# EAGLE design ArduinoWiFiShield101 (EAGLE 6.5.0)
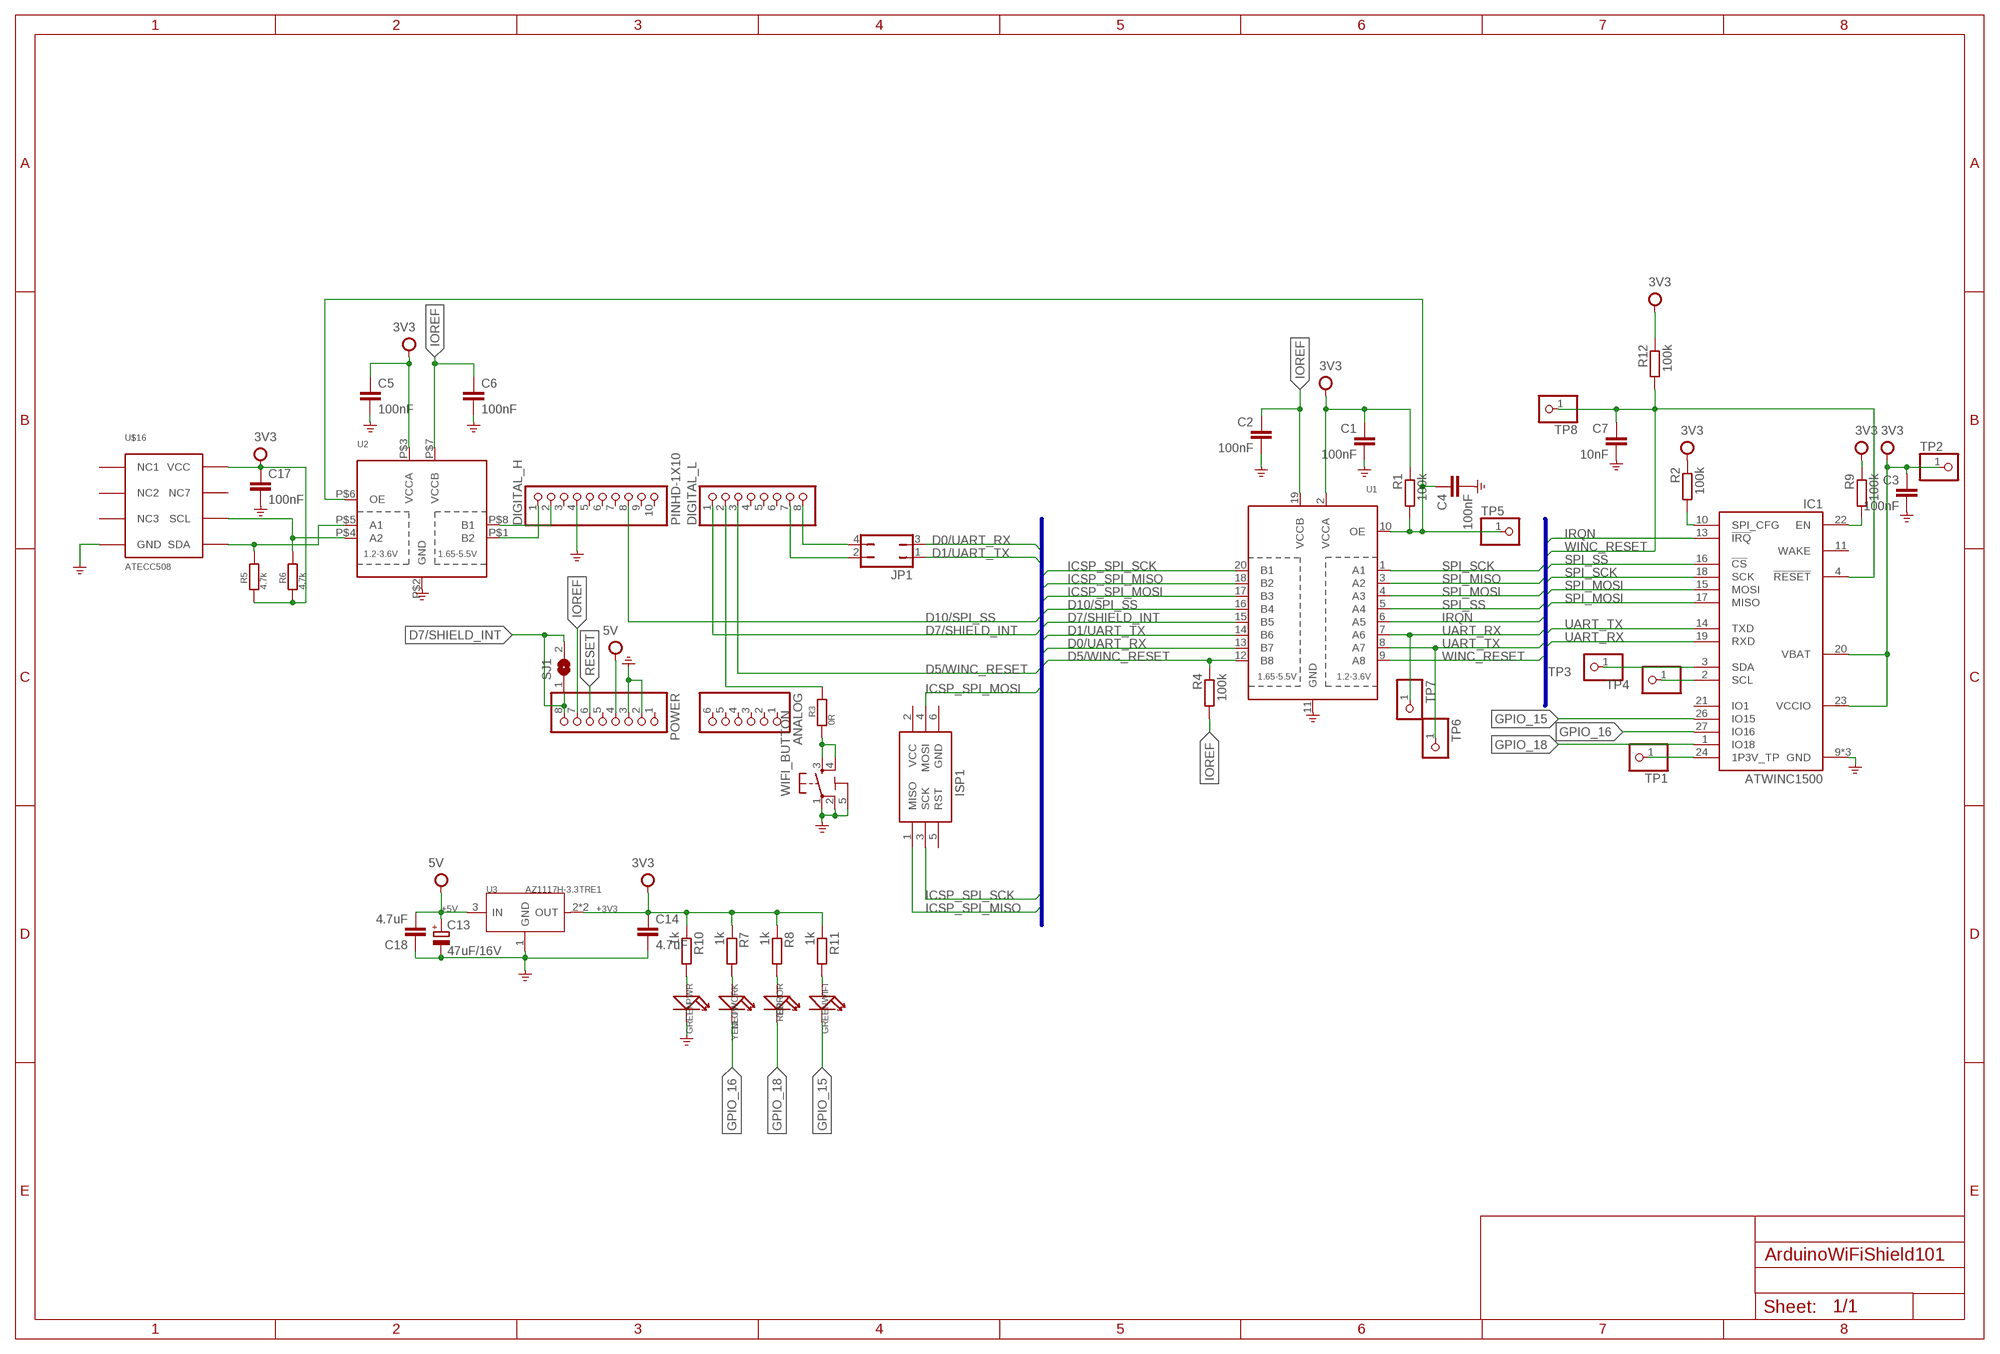
[diagram p0: schematic, sheet 1]

## Parts
ANALOG  PINHD-1X6B  [1X06-BIG]
C1  100nF  C-EUC0402  [C0402]
C2  100nF  C-EUC0402  [C0402]
C3  100nF  C-EUC0402  [C0402]
C4  100nF  C-EUC0402  [C0402]
C5  100nF  C-EUC0402  [C0402]
C6  100nF  C-EUC0402  [C0402]
C7  10nF  C-EUC0402  [C0402]
C13  47uF/16V  CPOL-EU140CLH-0810  [140CLH-0810]
C14  4.7uF  C-EUC0603  [C0603]
C17  100nF  C-EUC0402  [C0402]
C18  4.7uF  C-EUC0603  [C0603]
DIGITAL_H  PINHD-1X10  [1X10-BIG]
DIGITAL_L  PINHD-1X8BIG  [1X08-BIG]
ERROR  RED  LED'0603'  [LED-0603]
IC1  ATWINC1500  [ATWINC1500-MR210]
ISP1  AVRISP-6  [AVRISP]
JP1  JP2Q  [JP2Q]
NETWORK  YELLOW  LED'0603'  [LED-0603]
POWER  PINHD-1X8BIG  [1X08-BIG]
PWR  GREEN  LED'0603'  [LED-0603]
R1  100k  R-EU_R0402  [R0402]
R2  100k  R-EU_R0402  [R0402]
R3  0R  R-EU_R0402  [R0402]
R4  100k  R-EU_R0402  [R0402]
R5  4.7k  R-EU_R0402  [R0402]
R6  4.7k  R-EU_R0402  [R0402]
R7  1k  R-EU_R0402  [R0402]
R8  1k  R-EU_R0402  [R0402]
R9  100k  R-EU_R0402  [R0402]
R10  1k  R-EU_R0402  [R0402]
R11  1k  R-EU_R0402  [R0402]
R12  100k  R-EU_R0402  [R0402]
SJ1  SJ  [SJ]
TP1  PINHD-1X1_2.00  [1X01M]
TP2  PINHD-1X1_2.00  [1X01M]
TP3  PINHD-1X1_2.00  [1X01M]
TP4  PINHD-1X1_2.00  [1X01M]
TP5  PINHD-1X1_2.00  [1X01M]
TP6  PINHD-1X1_2.00  [1X01M]
TP7  PINHD-1X1_2.00  [1X01M]
TP8  PINHD-1X1_2.00  [1X01M]
U1  TXB0108PWR  [TSSOP20]
U2  TXS0102  [VFSOP-8]
U3  AZ1117H-3.3TRE1  LD1117S  [SOT-223]
U$16  ATECC508  [DFN-8.3X3.PAD]
WIFI  GREEN  LED'0603'  [LED-0603]
WIFI_BUTTON  TS42  [TS42]

## Nets
+3V3: C1.1 C3.1 C5.1 C14.1 C17.1 IC1.20(VBAT) IC1.23(VCCIO) R1.1 R2.1 R5.1 R6.1 R7.1 R8.1 R9.1 R10.1 R11.1 R12.1 TP2.1 U1.2(VCCA) U3.2(OUT) U3.TER(OUT) U$16.8(VCC) ; supply symbol labelled 3V3
+5V [usbvcc]: C13.+ C18.2 POWER.4 U3.3(IN) ; supply symbol labelled 5V
D0/UART_RX: JP1.3 U1.13(B7)
D1/UART_TX: JP1.1 U1.14(B6)
D5/WINC_RESET: DIGITAL_L.3 R4.1 U1.12(B8)
D7/SHIELD_INT: DIGITAL_L.1 POWER.8 SJ1.1 SJ1.2 U1.15(B5)
D10/SPI_SS: DIGITAL_H.8 U1.16(B4)
GND: C1.2 C2.2 C3.2 C4.2 C5.2 C6.2 C7.2 C13.- C14.2 C17.2 C18.1 DIGITAL_H.4 IC1.9(GND) IC1.12(GND) IC1.28(GND) POWER.2 POWER.3 PWR.- U1.11(GND) U2.P$2(GND) U3.1(GND) U$16.4(GND) U$16.PAD(GND) WIFI_BUTTON.1 WIFI_BUTTON.2 WIFI_BUTTON.5(5-GND)
GPIO_15: IC1.26(IO15) WIFI.-
GPIO_16: IC1.27(IO16) NETWORK.-
GPIO_18: ERROR.- IC1.1(IO18)
ICSP_SPI_MISO: ISP1.1(MISO) U1.18(B2)
ICSP_SPI_MOSI: ISP1.4(MOSI) U1.17(B3)
ICSP_SPI_SCK: ISP1.3(SCK) U1.20(B1)
IOREF: C2.1 C6.1 POWER.7 R4.2 U1.19(VCCB)
IRQN: IC1.13(!IRQ) U1.6(A5)
N$1: NETWORK.+ R7.2
N$2: DIGITAL_L.2 R3.1
N$3: DIGITAL_L.8 JP1.4
N$4: ERROR.+ R8.2
N$5: R11.2 WIFI.+
N$6: DIGITAL_L.7 JP1.2
N$7: C4.1 R1.2 TP5.1 U1.10(OE) U2.P$6(OE)
N$8: IC1.10(SPI_CFG) R2.2
N$9: IC1.22(EN) R9.2
N$10: DIGITAL_H.1 U2.P$1(B2)
N$11: R5.2 U2.P$5(A1) U$16.5(SDA)
N$12: IC1.24(1P3V_TP) TP1.1
N$13: IC1.3(SDA) TP3.1
N$14: IC1.2(SCL) TP4.1
N$15: R3.2 WIFI_BUTTON.3 WIFI_BUTTON.4
N$26: PWR.+ R10.2
RESET: POWER.6
SCL: R6.2 U2.P$4(A2) U$16.6(SCL)
SDA: DIGITAL_H.2 U2.P$8(B1)
SPI_MISO: IC1.17(MISO) U1.3(A2)
SPI_MOSI: IC1.15(MOSI) U1.4(A3)
SPI_SCK: IC1.18(SCK) U1.1(A1)
SPI_SS: IC1.16(!CS) U1.5(A4)
UART_RX: IC1.19(RXD) TP7.1 U1.7(A6)
UART_TX: IC1.14(TXD) TP6.1 U1.8(A7)
WINC_RESET: C7.1 IC1.4(!RESET) R12.2 TP8.1 U1.9(A8)
Unconnected: ANALOG.1 ANALOG.2 ANALOG.3 ANALOG.4 ANALOG.5 ANALOG.6 DIGITAL_H.3 DIGITAL_H.5 DIGITAL_H.6 DIGITAL_H.7 DIGITAL_H.9 DIGITAL_H.10 DIGITAL_L.4 DIGITAL_L.5 DIGITAL_L.6 IC1.11(WAKE) IC1.21(IO1) ISP1.5(RST) POWER.1 POWER.5 U2.P$3(VCCA) U2.P$7(VCCB) U$16.1(NC1) U$16.2(NC2) U$16.3(NC3) U$16.7(NC7)

## Buses
ICSP_SPI_SCK,ICSP_SPI_MISO,ICSP_SPI_MOSI,D10/SPI_SS,D7/SHIELD_INT,D0/UART_RX,D1/UART_TX,D5/WINC_RESET
SPI_SCK,SPI_MISO,SPI_MOSI,SPI_SS,IRQN,UART_RX,UART_TX,WINC_RESET

## Power pins joined to a net without a drawn wire
3V3: ISP1.2(VCC)
GND: ISP1.6(GND)

## Library data of the parts
ANALOG = adafruit:PINHD-1X6: PIN HEADER
C1-C7 C14 C17 C18 = rcl:C-EU: CAPACITOR, European symbol
C13 = rcl:CPOL-EU: POLARIZED CAPACITOR, European symbol
DIGITAL_H = adafruit:PINHD-1X10: Pin header 1x10 0.1" spacing With round pins
DIGITAL_L POWER = adafruit:PINHD-1X8: PIN HEADER
ERROR NETWORK PWR WIFI = Discrete:LED*
IC1 = we-chip:ATWINC1500: Atmel ATWINC1500-MR210 WiFi/WLAN 802.11 b/g/n
ISP1 = adafruit:AVRISP: AVR ISP HEADER Standard 6 pin header for AVR programming
JP1 = jumper:JP2Q: JUMPER
R1-R12 = rcl:R-EU_: RESISTOR, European symbol
SJ1 = jumper:SJ: SMD solder JUMPER
TP1-TP8 = pinhead-1:PINHD-1X1: PIN HEADER
U1 = adafruit:TXB0108PWR: 8-Bit Bi-Directional Level Shifter 1.2V-3.6V (VCCA) to 1.65V-5.5V (VCCB) bi-directional level shifter with auto direction sensing. Max data rate - VCCA 1.8V: 20Mbps (50ns), VCCA 3.3V: 100Mbps (10ns) Digikey: 296-21527-1-ND
U2 = adafruit:TXS0102: 2-Bit Bi-Directional Level Shifter (I2C, etc.) Designed for I2C devices and has internal pullups. Not to be confused with TXB010x series. 1.2V-3.6V (VCCA) to 1.65V-5.5V (VCCB) bi-directional level shifter with auto direction sensing. Max data rate - 24Mbps (Push Pull), 2Mbps (Open Drain) Digikey: 296-21931-1-ND
U3 = IC:LD1117: Low Drop Fixed And Adjustable Positive Voltage Regulators http://www.datasheetcatalog.org/datasheet/SGSThomsonMicroelectronics/mXuqtqv.pdf
U$16 = Arduino:ATECC508
WIFI_BUTTON = Arduino:TS42: TS42 Dongnan Electronics Tact switch VDC 12V - 50mA

## Net classes
0 default: width 0.203 mm, drill 0.305 mm, clearance 0.203 mm
3 usbvcc: width 0.203 mm, drill 0.305 mm, clearance 0.203 mm

## Board
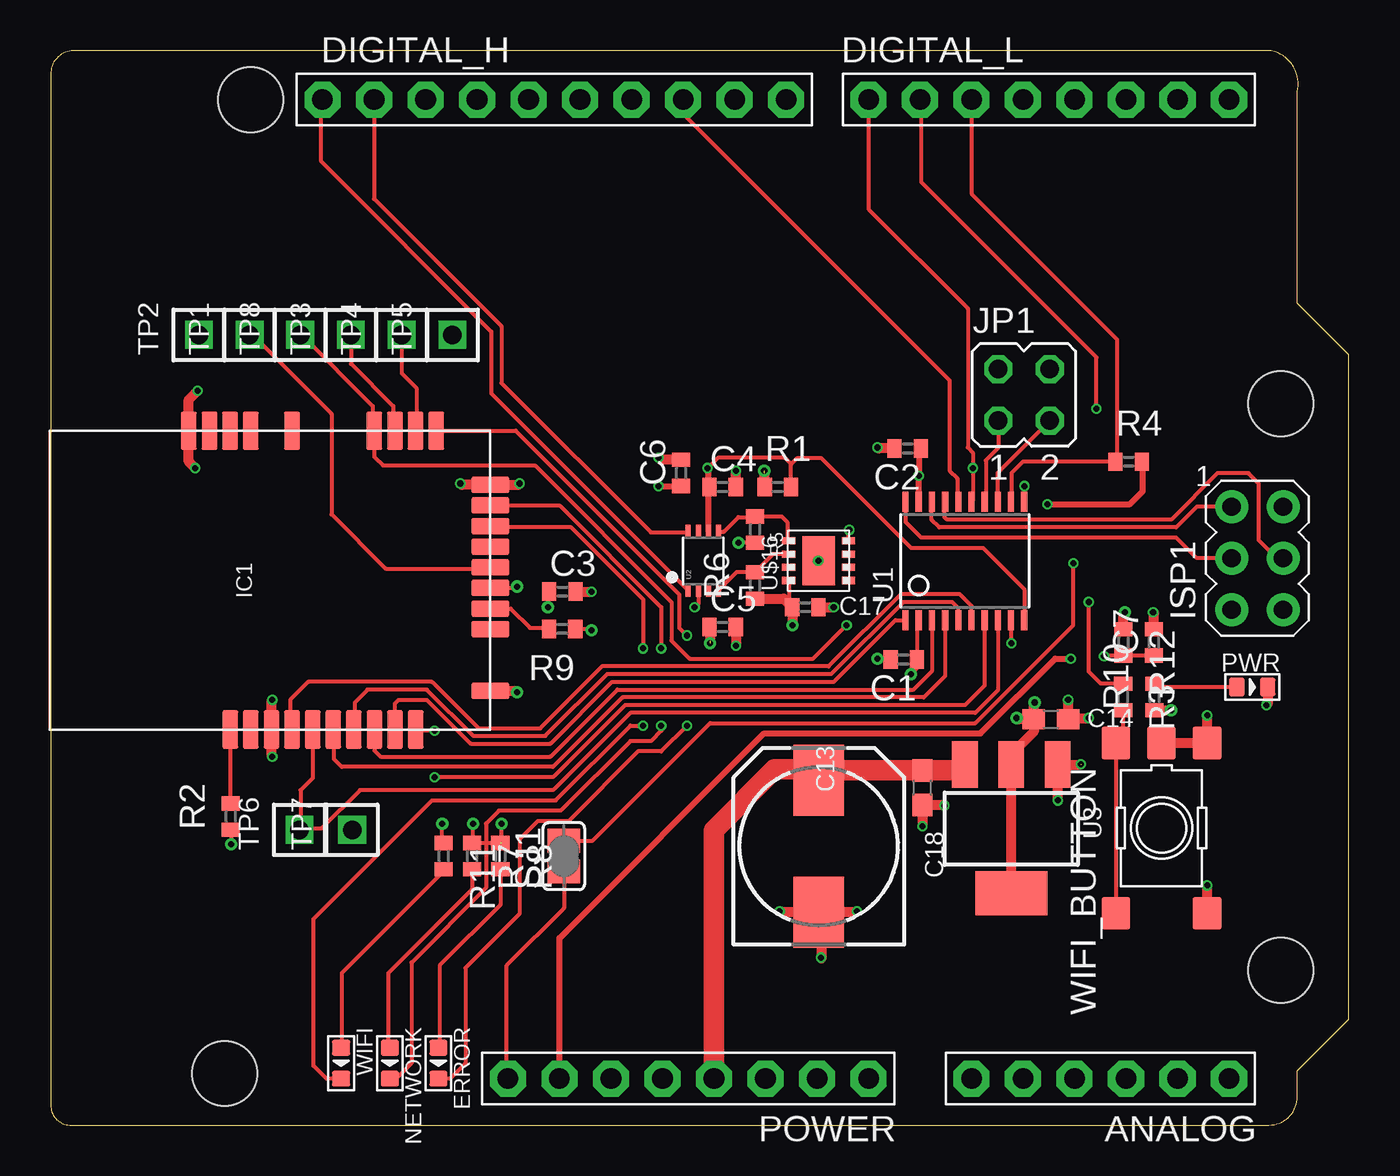
[diagram p1: board, top side]
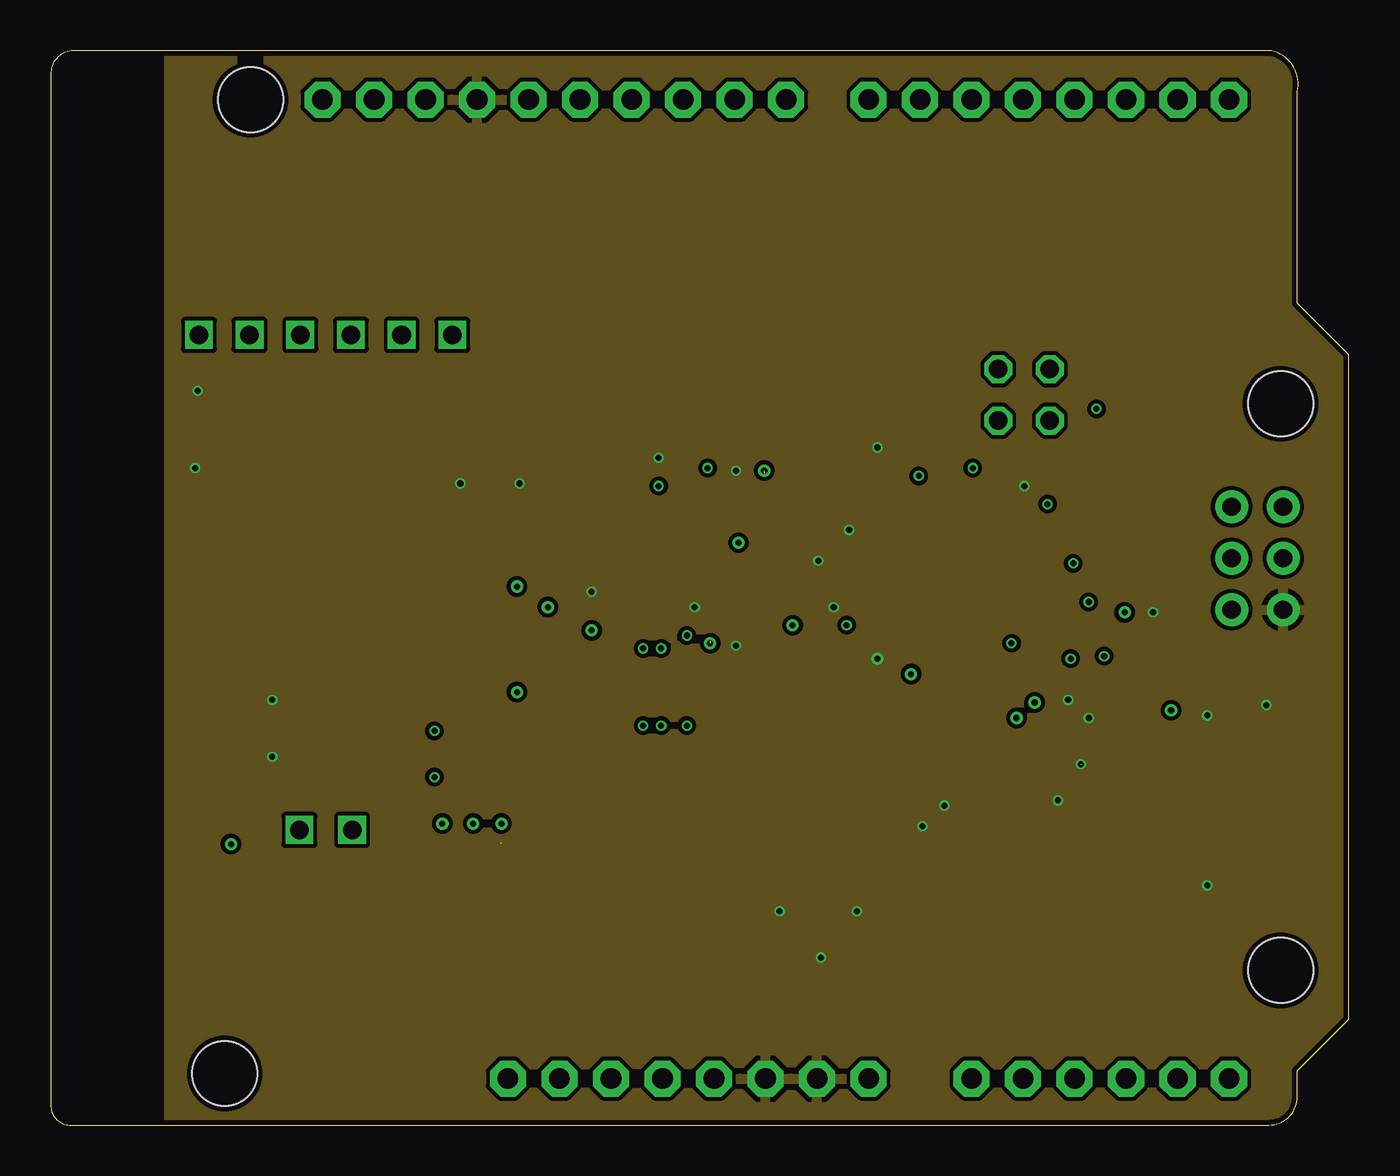
[diagram p2: board, inner layer GND_PLANE]
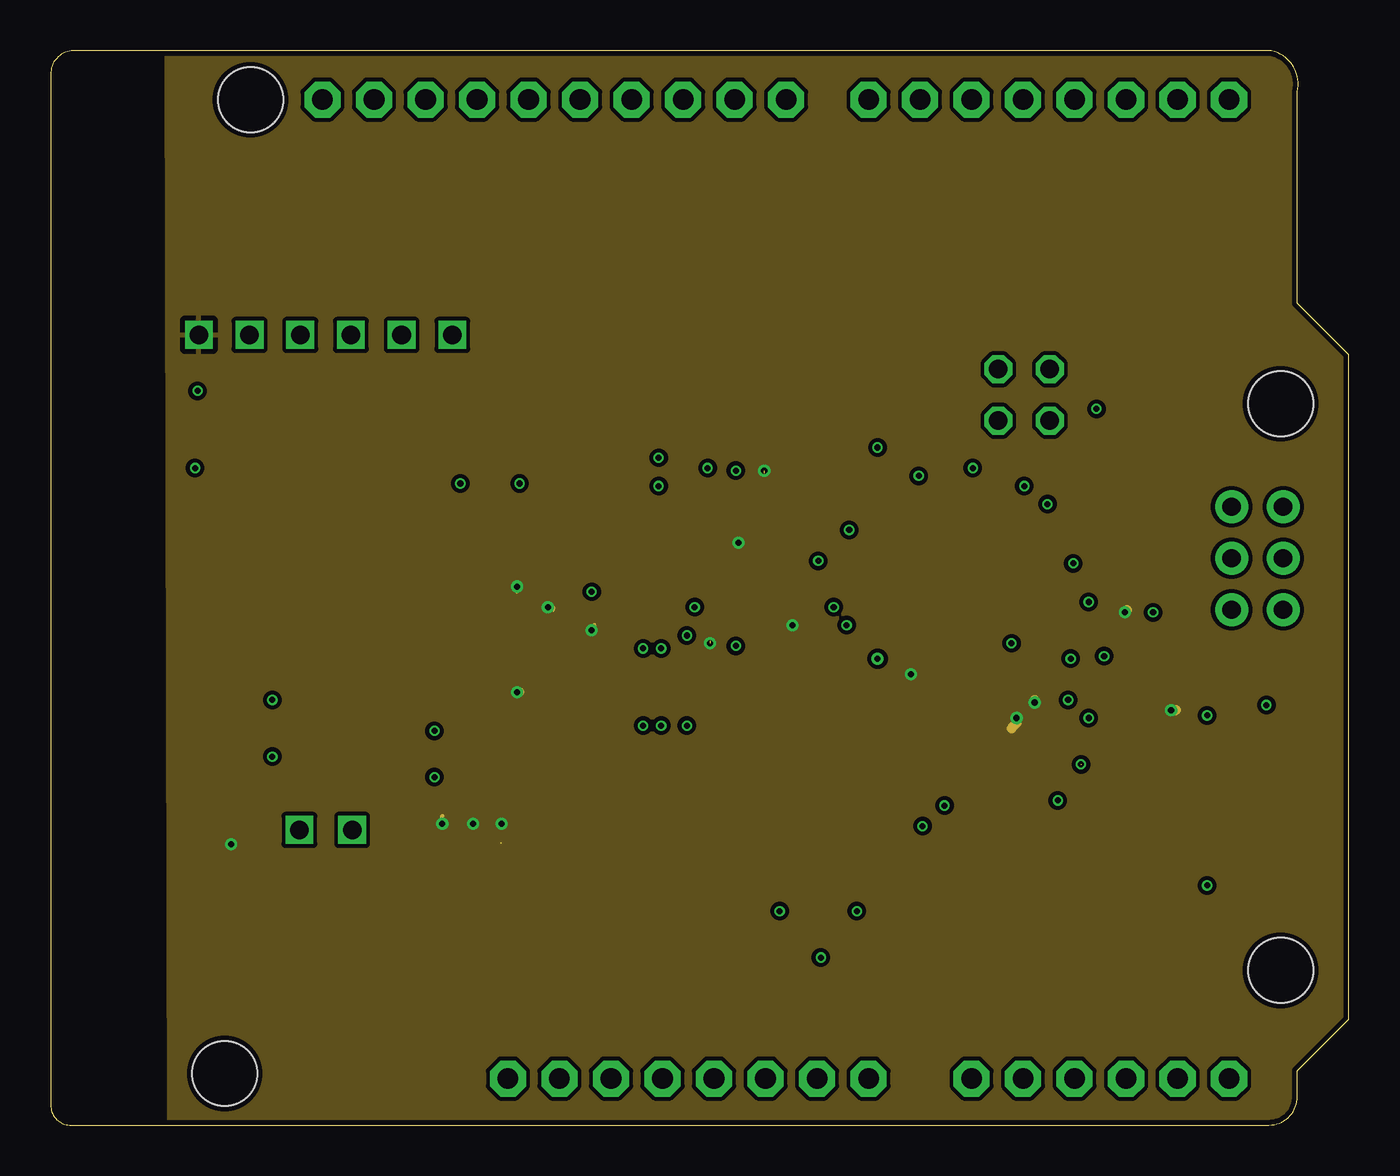
[diagram p3: board, inner layer POWER_PLANE]
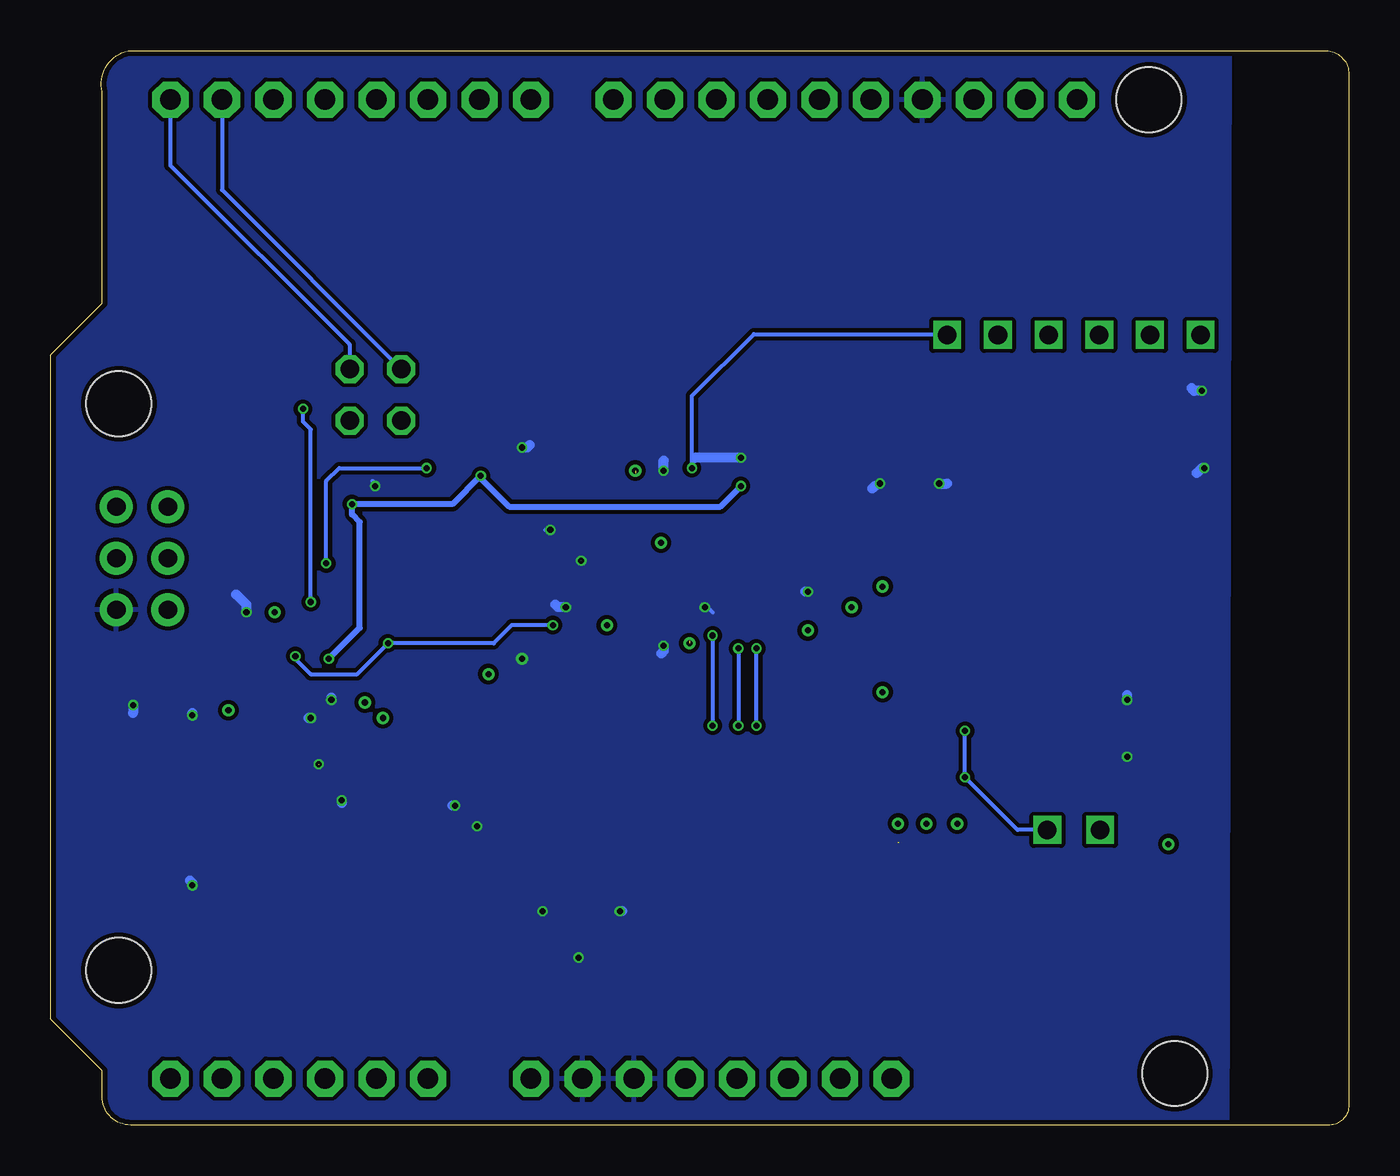
[diagram p4: board, bottom side, seen from below]

Size 64.01 x 52.96 mm. Coordinates in mm from the lower left corner, seen from the top.
Outline: 0.01,51.69 0.01,0.89 arc90 1.02,0 60.08,0 arc90 61.47,1.4 61.47,2.67 64.01,5.21 64.01,37.97 61.47,40.51 61.47,50.93 arc90 60.2,52.96 1.02,52.96 arc90 0.01,51.69
Copper layers (1*2*15*16): Top 0.035mm / dielectric 0.2mm / GND_PLANE 0.0175mm / dielectric 0.3mm / POWER_PLANE 0.0175mm / dielectric 0.2mm / Bottom 0.035mm
Design rules "SeeedStudio_4layer_DRU_no_angle_20140221 *": minimum track width 8mil, minimum drill 12mil, track to track 8mil, track to pad 8mil, pad to pad 8mil, via to via 8mil, smd to smd 0mil, copper to edge 10mil, drill to drill 8mil, minimum pad ring 6mil, minimum via ring 4mil, stop-mask expansion 4mil, vias tented up to drill 25mil, thermal gap 10mil
Holes 3.2 mm at 60.65,7.62 8.58,2.54 9.85,50.55 60.65,35.56

### Footprints (pad centres in the part's own frame; a part is rotated, then mirrored left to right if it is on the bottom)
1X06-BIG = drill 1.016 pad 1.778 octagon: 1 -6.35,0; 2 -3.81,0; 3 -1.27,0; 4 1.27,0; 5 3.81,0; 6 6.35,0
C0402 = smd 0.7 x 0.9: 1 -0.65,0; 2 0.65,0
140CLH-0810 = smd 3.5 x 2.5: + 3.25,0; - -3.25,0
C0603 = smd 1.1 x 1: 1 -0.85,0; 2 0.85,0
1X10-BIG = drill 1.016 pad 1.778 octagon: 1 -11.43,0; 2 -8.89,0; 3 -6.35,0; 4 -3.81,0; 5 -1.27,0; 6 1.27,0; 7 3.81,0; 8 6.35,0; 9 8.89,0; 10 11.43,0
1X08-BIG = drill 1.016 pad 1.778 octagon: 1 -8.89,0; 2 -6.35,0; 3 -3.81,0; 4 -1.27,0; 5 1.27,0; 6 3.81,0; 7 6.35,0; 8 8.89,0
LED-0603 = smd 0.762 x 0.889: + -0.762,0; - 0.762,0
ATWINC1500-MR210 = smd 1.9 x 0.8: 1 7.365,-8.19; 2 7.365,-7.174; 3 7.365,-6.158; 4 7.365,-5.142; 5 7.365,-1.078; 6 7.365,0.954; 7 7.365,1.97; 8 7.365,2.986; 9 7.365,4.002; 10 -7.365,1.964; 11 -7.365,0.948; 12 -7.365,-0.068; 13 -7.365,-1.084; 14 -7.365,-2.1; 15 -7.365,-3.116; 16 -7.365,-4.132; 17 -7.365,-5.148; 18 -7.365,-6.164; 19 -7.365,-7.18 | smd 0.8 x 1.9: 20 -5.465,-10.86; 21 -2.417,-10.86; 22 -1.401,-10.86; 23 -0.385,-10.86; 24 0.631,-10.86; 25 1.647,-10.86; 26 2.663,-10.86; 27 3.679,-10.86; 28 4.695,-10.86
AVRISP = drill 0.9 pad 1.626: 1 -1.27,2.54; 2 1.27,2.54; 3 -1.27,0; 4 1.27,0; 5 -1.27,-2.54; 6 1.27,-2.54
JP2Q = drill 0.914 octagon: 1 -1.27,-1.27; 2 -1.27,1.27; 3 1.27,-1.27; 4 1.27,1.27
R0402 = smd 0.7 x 0.9: 1 -0.65,0; 2 0.65,0
SJ = smd 1.168 x 1.6: 1 -0.762,0; 2 0.762,0
1X01M = drill 0.914 square: 1 0,0
TSSOP20 = smd 0.305 x 0.991: 1 -2.925,-2.918; 2 -2.275,-2.918; 3 -1.625,-2.918; 4 -0.975,-2.918; 5 -0.325,-2.918; 6 0.325,-2.918; 7 0.975,-2.918; 8 1.625,-2.918; 9 2.275,-2.918; 10 2.925,-2.918; 11 2.925,2.918; 12 2.275,2.918; 13 1.625,2.918; 14 0.975,2.918; 15 0.325,2.918; 16 -0.325,2.918; 17 -0.975,2.918; 18 -1.625,2.918; 19 -2.275,2.918; 20 -2.925,2.918
VFSOP-8 = smd 0.25 x 0.65: P$1 -0.75,-1.45; P$2 -0.25,-1.45; P$3 0.25,-1.45; P$4 0.75,-1.45; P$5 0.75,1.45; P$6 0.25,1.45; P$7 -0.25,1.45; P$8 -0.75,1.45
SOT-223 = smd 1.27 x 2.286: 1 -2.286,-3.175; 2 0,-3.175; 3 2.286,-3.175 | smd 3.556 x 2.159: TER 0,3.175
DFN-8.3X3.PAD = smd 0.35 x 0.65: 1 -0.975,-1.475; 2 -0.325,-1.475; 3 0.325,-1.475; 4 0.975,-1.475; 5 0.975,1.475; 6 0.325,1.475; 7 -0.325,1.475; 8 -0.975,1.475 | smd 2.4 x 1.6: PAD 0,0
TS42 = smd 1.6 x 1.4: 1 -4.2,2.25; 2 4.2,2.25; 3 -4.2,-2.25; 4 4.2,-2.25; 5 -4.2,0

### Placement (x,y rotation side)
ANALOG  51.76,2.29 180 top
C1  42.07,22.95 180 top
C2  42.26,33.35 180 top
C3  25.23,26.3 0 top
C4  33.14,31.45 0 top
C5  33.14,24.55 0 top
C6  31.09,32.15 90 top
C7  54.4,23.79 90 top
C13  37.88,13.74 90 top
C14  49.33,20 0 top
C17  37.22,25.53 0 top
C18  42.99,16.63 90 top
DIGITAL_H  24.84,50.55 0 top
DIGITAL_L  49.22,50.55 0 top
ERROR  19.12,3.05 270 top
IC1  10.82,26.86 90 top
ISP1  59.51,27.94 0 top
JP1  48,35.99 0 top
NETWORK  16.72,3.05 270 top
POWER  31.44,2.29 180 top
PWR  59.25,21.59 0 top
R1  35.86,31.45 0 top
R2  8.88,15.2 90 top
R3  52.88,21.1 270 top
R4  53.16,32.7 0 top
R5  34.74,29.35 90 top
R6  34.74,26.6 90 top
R7  20.78,13.25 270 top
R8  22.18,13.25 270 top
R9  25.22,24.46 180 top
R10  54.43,21.1 90 top
R11  19.38,13.25 270 top
R12  52.9,23.79 270 top
SJ1  25.31,13.25 90 top
TP1  9.81,38.95 0 top
TP2  7.31,38.95 0 top
TP3  14.81,38.95 0 top
TP4  17.31,38.95 0 top
TP5  19.81,38.95 0 top
TP6  12.27,14.55 0 top
TP7  14.87,14.55 0 top
TP8  12.31,38.95 0 top
U1  45.08,27.81 0 top
U2  32.19,27.81 0 top
U3  47.37,14.61 180 top
U$16  37.87,27.82 90 top
WIFI  14.32,3.05 270 top
WIFI_BUTTON  54.78,14.63 270 top

### Tracks (layer width: path | path; a pad name or v marks a point on that pad's centre or on a via)
+3V3  (via drill 0.3 pad 0.6)  (3 unrouted)
  Top 0.2: R11.1 19.31,13.9 v19.31,14.86 | v20.83,14.86 20.83,13.9 R7.1 22.23,13.9 v22.23,14.86 | R2.1 8.9,14.55 v8.9,13.84 | IC1.23 22.99,26.48 v22.99,26.54 | C3.1 24.52,26.3 v24.52,25.53 | R9.1 26.68,24.46 v26.68,24.39 | U1.2 42.72,24.89 C1.1 42.72,22.52 v42.42,22.23 | U$16.8 36.39,25.7 C17.1 | 36.57,24.65 v36.58,24.64 | R5.1 v33.92,28.7
  Top 0.5: IC1.20 22.99,21.4 v22.99,21.34 | 36.57,24.65 C17.1 36.14,25.95 R6.1 | U3.TER U3.2 47.38,17.79 47.38,18.29 48.48,19.39 C14.1 | C14.1 48.48,20.79 v48.52,20.83 | C14.1 47.7,20 v47.63,20.07 | R12.1 52.9,25.08 v52.97,25.27 | R10.1 v55.25,20.45 | C5.1 32.52,24.55 32.52,23.88 | R1.1 35.21,32.11 35.19,32.13
  POWER_PLANE 0.2: v19.31,14.86 19.31,15.24 | v20.83,14.86 20.83,14.99 | v22.23,14.86 22.23,14.99 | v8.9,13.84 8.9,13.72 | v22.99,26.54 22.99,26.29 | v24.52,25.53 24.77,25.53 24.77,25.4 | v26.68,24.39 26.8,24.39 26.8,24.64 | v42.42,22.23 42.3,22.1 | v36.58,24.64 36.46,24.64
  POWER_PLANE 0.5: v22.99,21.34 23.12,21.34 | v48.52,20.83 48.52,20.96 | v47.63,20.07 47.63,19.81 47.38,19.56 | v52.97,25.27 53.09,25.4 | v55.25,20.45 55.51,20.45
  other vias: 32.52,23.75 35.19,32.26
  pour POWER_PLANE: 5.72,52.96 60.46,52.96 61.09,52.58 61.35,52.07 61.47,51.56 61.47,40.51 64.01,37.97 64.01,5.08 61.47,2.67 61.35,1.02 61.22,0.51 60.59,0 5.85,0
+5V
  Top 0.813: 37.9,17.48 C13.+
  Top 1: POWER.4 32.71,14.54 35.69,17.53 37.85,17.53 C13.+ | 37.9,17.48 C18.2 44.78,17.48 U3.3
D0/UART_RX
  Top 0.2: U1.13 46.71,32.16 JP1.3
D1/UART_TX
  Top 0.2: JP1.1 46.73,33.39 46.11,32.77 46.11,30.78 U1.14
D5/WINC_RESET
  Top 0.2: DIGITAL_L.3 45.41,45.91 52.58,38.74 52.58,32.78 R4.1 47.95,32.7 47.38,32.13 47.38,30.75 U1.12
D7/SHIELD_INT  (via drill 0.3)
  Top 0.2: DIGITAL_L.1 40.33,45.15 45.22,40.26 45.22,33.4 45.47,33.15 v45.47,32.39 45.47,30.79 U1.15 | v50.43,27.69 50.43,24.64 45.6,19.81 32.52,19.81 26.72,14.02 SJ1.2 SJ1.1 25.31,10.7 22.49,7.88 22.49,2.29 POWER.8
  Bottom 0.2: v45.47,32.39 49.79,32.39 50.43,31.75 v50.43,27.69
D10/SPI_SS
  Top 0.2: DIGITAL_H.8 31.19,49.85 44.33,36.7 44.33,32.26 44.71,31.88 44.71,30.77 U1.16
GND  (via drill 0.3, 0.3 pad 0.6)  (2 unrouted)
  Top 0.2: U1.11 v48.01,31.49 v48.01,31.5 | U$16.4 39.34,29.31 v39.38,29.34 | U2.P$2 31.94,25.71 v31.76,25.53 | C1.2 40.81,22.95 v40.77,22.99
  Top 0.5: v23.12,31.62 23.06,31.56 IC1.28 20.27,31.56 v20.2,31.62 | v10.93,20.96 10.89,20.91 IC1.12 10.89,18.23 | v35.95,10.54 36,10.49 C13.- 38,10.49 | 39.65,10.49 38,10.49 | 38,10.49 38,8.21 | v44.08,15.75 44.05,15.78 C18.1 42.99,14.76 | U3.1 49.65,16.01 v49.66,16 | 49.79,17.77 50.8,17.77 | C14.2 v50.18,20.95 v50.17,20.96 | 50.23,20.06 v51.18,20.06 v51.19,20.07 | v57.03,20.19 WIFI_BUTTON.1 WIFI_BUTTON.5 | WIFI_BUTTON.2 v57.03,11.81 | PWR.- 60.02,20.77 v59.95,20.7 | v7.25,36.2 6.82,35.77 IC1.9 6.82,32.7 6.86,32.66 6.86,32.64 v7.12,32.39 | C6.2 30.07,32.8 v29.98,32.89 | C4.2 v33.79,32.26 | C17.2 v38.61,25.53 | C5.2 v33.79,23.63 v33.79,23.62 | C2.2 40.82,33.35 v40.77,33.4 | C3.2 v26.67,26.3 v26.68,26.29 | C7.2 54.4,25.24 v54.36,25.27
  Bottom 0.2: v48.01,31.5 48.01,31.62 48.14,31.75 | v39.38,29.34 39.63,29.34 | v31.76,25.53 31.63,25.53 31.38,25.27 | v40.77,22.99 40.65,22.99
  Bottom 0.5: v23.12,31.62 23.37,31.5 23.5,31.37 | v20.2,31.62 19.82,31.62 | v10.93,20.96 10.93,21.21 | 35.82,10.54 v35.95,10.54 | v44.08,15.75 44.2,15.75 | v49.66,16 49.66,15.88 | v50.17,20.96 50.17,21.08 | v51.19,20.07 51.31,20.07 | v57.03,20.19 57.03,20.32 | v57.03,11.81 57.03,11.94 57.16,12.07 | v59.95,20.7 59.95,20.32 | v7.25,36.2 7.63,36.2 7.75,36.32 | v7.12,32.39 7.25,32.39 7.5,32.13 | v29.98,32.89 32.26,32.89 | v33.79,32.26 33.79,32.77 | v38.61,25.53 39,25.53 39.12,25.66 | v33.79,23.62 33.79,23.37 33.92,23.24 | v40.77,33.4 40.52,33.4 40.39,33.53 | v26.68,26.29 26.8,26.29 | v54.36,25.27 54.36,25.66 54.87,26.16
  other vias: 10.93,18.16 39.76,10.54 37.98,8.26 42.99,14.73 50.81,17.78 37.85,27.81
  pour Bottom: 5.85,55.12 65.67,55.25 65.67,-2.92 5.98,-3.05
  pour GND_PLANE: 5.72,52.96 arc-90 5.85,53.09 60.08,53.09 arc-90 61.35,51.82 61.35,50.67 arc-90 61.47,50.55 61.47,40.51 64.01,37.97 64.01,5.34 61.47,2.67 61.47,1.27 arc-90 60.33,0.13 5.85,0.13 5.85,52.83 arc90
GPIO_15  (via drill 0.3)
  Top 0.2: WIFI.- 13.6,2.29 12.96,2.92 12.96,10.16 18.8,16 24.9,16 28.58,19.69 v29.22,19.69 | IC1.26 21.74,29.47 25.66,29.47 29.22,25.91 v29.22,23.5
  Bottom 0.2: v29.22,19.69 v29.22,23.5
GPIO_16  (via drill 0.3)
  Top 0.2: v30.11,19.69 30.11,19.43 29.6,18.92 28.58,18.92 25.15,15.5 22.1,15.5 21.47,14.86 21.47,11.69 17.79,8 17.79,3.05 17.02,2.29 NETWORK.- | IC1.27 25.09,30.54 30.11,25.53 v30.11,23.5
  Bottom 0.2: v30.11,23.5 v30.11,19.69
GPIO_18  (via drill 0.3)
  Top 0.2: IC1.1 22.93,34.23 30.99,26.16 30.99,24.51 v31.38,24.13 | v31.38,19.69 30.11,18.42 28.96,18.42 25.53,14.99 24.01,14.99 23.12,14.1 23.12,10.42 20.45,7.75 20.45,3.05 19.69,2.29 ERROR.-
  Bottom 0.2: v31.38,24.13 v31.38,19.69
ICSP_SPI_MISO
  Top 0.2: ISP1.1 56.52,30.48 55.51,29.47 43.82,29.47 43.44,29.85 43.44,30.71 U1.18
ICSP_SPI_MOSI
  Top 0.2: ISP1.4 60.46,27.94 59.57,28.83 59.57,31.62 59.06,32.13 57.54,32.13 55.25,29.85 44.2,29.85 44.08,29.97 44.08,30.7 U1.17
ICSP_SPI_SCK
  Top 0.2: ISP1.3 56.52,27.94 55.51,28.96 42.93,28.96 42.17,29.72 42.17,30.71 U1.20
IOREF  (via drill 0.3)
  Top 0.2: 42.81,33.25 C2.1
  Top 0.3: POWER.7 25.09,9.21 35.19,19.31 45.85,19.31 49.54,22.99 v50.3,22.99 | v49.16,30.61 53.22,30.61 53.85,31.24 53.85,32.65 R4.2 | U1.19 v42.81,32.01 42.81,33.25 | v29.98,31.5 C6.1
  Bottom 0.3: v50.3,22.99 48.77,24.51 48.77,29.72 49.16,30.1 v49.16,30.61 44.2,30.61 v42.81,32.01 42.81,31.88 41.41,30.48 30.99,30.48 v29.98,31.5
IRQN
  Top 0.2: U1.6 45.41,25.6 44.84,26.16 41.92,26.16 38.36,22.61 27.18,22.61 24.14,19.56 21.09,19.56 18.8,21.85 12.71,21.85 11.82,20.96 11.82,19.58 IC1.13
N$1
  Top 0.2: R7.2 20.78,11.63 16.64,7.49 16.64,3.89 NETWORK.+
N$2  (via drill 0.3)
  Top 0.2: R3.1 51.79,21.75 51.19,22.35 v51.19,25.78 | v51.57,35.31 51.57,37.85 42.93,46.48 42.93,50.74 DIGITAL_L.2
  Bottom 0.2: v51.19,25.78 51.19,34.29 51.57,34.67 v51.57,35.31
N$3
  Bottom 0.2: DIGITAL_L.8 58.11,47.31 49.28,38.48 49.28,37.27 JP1.4
N$4
  Top 0.2: R8.2 22.18,10.87 19.18,7.88 19.18,3.87 ERROR.+
N$5
  Top 0.2: R11.2 19.38,12.52 14.36,7.49 14.36,3.85 WIFI.+
N$6
  Bottom 0.2: DIGITAL_L.7 55.57,46.1 JP1.2
N$7  (via drill 0.3)
  Top 0.2: v32.39,32.39 32.9,32.89 36.2,32.89 36.51,32.59 R1.2 36.51,32.56 36.84,32.89 37.98,32.89 42.42,28.45 45.98,28.45 48.01,26.42 U1.10
  Top 0.3: U2.P$6 32.44,31.4 | 32.44,31.4 C4.1 | 32.44,31.4 32.44,32.34 v32.39,32.39
  Bottom 0.2: v32.39,32.39 32.39,35.94 29.34,38.99 19.84,38.99
  Bottom 0.3: 19.84,38.99 TP5.1
N$8
  Top 0.2: R2.2 8.88,19.47 IC1.10
N$9
  Top 0.2: IC1.22 22.68,25.46 23.63,24.51 24.52,24.51 R9.2
N$10
  Top 0.2: DIGITAL_H.1 13.34,50.74 13.34,47.5 21.72,39.12 21.72,36.07 U2.P$1 31.38,26.42
N$11
  Top 0.2: U2.P$5 33.2,29.26 33.92,29.97 34.71,29.97 R5.2 36.05,30 36.33,29.72 36.33,28.86 U$16.5
N$12
  Top 0.2: TP1.1 9.95,38.95 13.85,35.05 13.85,30.1 16.52,27.43 21.62,27.43 IC1.24
N$13
  Top 0.2: TP3.1 14.81,37.53 16.9,35.43 16.9,34.31 IC1.3
N$14
  Top 0.2: TP4.1 17.31,37.06 18.04,36.32 18.04,34.28 IC1.2
N$15
  Top 0.2: WIFI_BUTTON.4 WIFI_BUTTON.3 52.88,19.18 R3.2
N$26
  Top 0.2: PWR.+ 54.59,21.59 R10.2
SCL
  Top 0.2: U2.P$4 33.83,27.25 R6.2 35.63,28.15 U$16.6
SDA
  Top 0.2: DIGITAL_H.2 15.95,45.66 22.23,39.37 22.23,36.58 29.6,29.21 31.39,29.21 U2.P$8
SPI_MISO
  Top 0.2: U1.3 43.46,22.37 42.55,21.46 27.95,21.46 24.64,18.16 16.26,18.16 15.97,18.46 IC1.17
SPI_MOSI
  Top 0.2: U1.4 44.11,22.13 43.06,21.08 28.2,21.08 24.77,17.65 14.36,17.65 13.98,18.04 13.98,19.46 IC1.15
SPI_SCK
  Top 0.2: IC1.18 16.98,20.79 17.15,20.96 18.55,20.96 20.71,18.8 24.64,18.8 27.69,21.85 38.61,21.85 41.66,24.89 U1.1
SPI_SS
  Top 0.2: U1.5 44.76,25.48 44.46,25.78 42.04,25.78 38.49,22.23 27.44,22.23 24.39,19.18 20.83,19.18 18.55,21.46 15.63,21.46 14.99,20.83 14.99,19.54 IC1.16
UART_RX  (via drill 0.3)
  Top 0.2: U1.7 46.06,21.67 45.09,20.7 28.33,20.7 24.77,17.15 v18.93,17.15 | v18.93,19.43 18.06,19.43 IC1.19
  Bottom 0.2: v18.93,19.43 v18.93,17.15 16.33,14.55 TP7.1
UART_TX
  Top 0.2: IC1.14 12.92,17.1 12.33,16.51 12.33,14.61 TP6.1 12.32,14.61 13.34,14.61 15.25,16.51 24.77,16.51 28.58,20.32 45.6,20.32 46.71,21.43 U1.8
WINC_RESET  (via drill 0.3)
  Top 0.2: C7.1 R12.2 51.98,23.14 v51.95,23.12 | TP8.1 12.36,38.95 15.88,35.43 15.88,34.31 IC1.4 15.96,32.94 16.39,32.51 23.88,32.51 30.61,25.78 30.61,23.88 31.5,22.99 37.6,22.99 v39.25,24.64 | v47.38,23.75 47.38,24.87 U1.9
  Bottom 0.2: v39.25,24.64 41.28,24.64 42.17,23.75 v47.38,23.75 48.9,22.23 51.19,22.23 51.95,22.99 v51.95,23.12